# Altium project ESP32_Accelerometer.PrjPcb
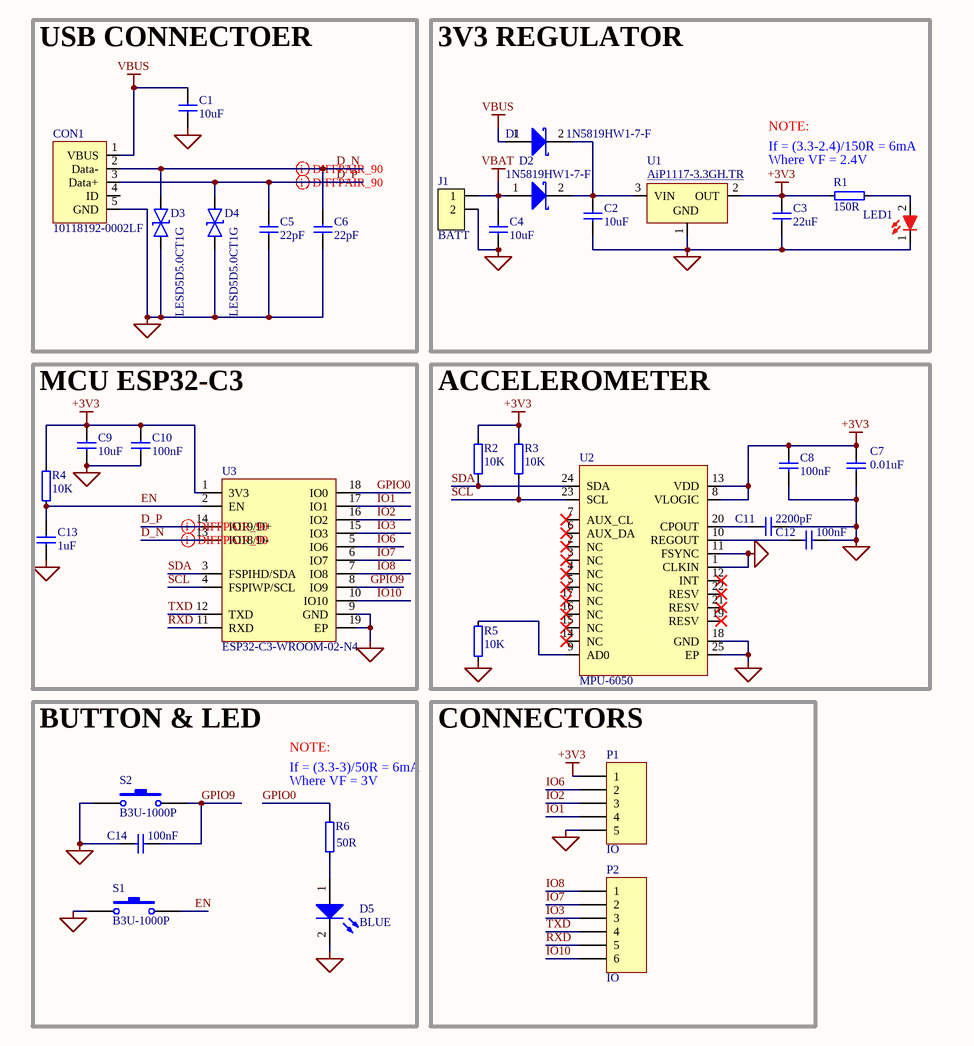
[diagram p0: ESP32_Accelerometer.SchDoc]
1 sheet, 35 parts. Net scope: global (net labels, ports and power ports of the same name join across sheets).
Board file: PCB.PcbDoc

## Sheet ESP32_Accelerometer.SchDoc
size A3

### Parts
C1  10uF  [CAPC1608X06L]
C2  10uF  [CAPC1608X06L]
C3  22uF  [CAPC1608X06L]
C4  10uF  [CAPC1608X06L]
C5  22pF  [CAPC1005X04L]
C6  22pF  [CAPC1005X04L]
C7  0.01uF  [CAPC1005X04L]
C8  100nF  [CAPC1005X04L]
C9  10uF  [CAPC1005X04L]
C10  100nF  [CAPC1005X04L]
C11  2200pF  [CAPC1005X04L]
C12  100nF  [CAPC1005X04L]
C13  1uF  [CAPC1005X04L]
C14  100nF  [CAPC1005X04L]
CON1  10118192-0002LF  [CONN_USB-B-MICRO-SMD-10118192-0002LF]
D1  1N5819HW1-7-F  [SOD-123FL]
D2  1N5819HW1-7-F  [SOD-123FL]
D3  LESD5D5.0CT1G  [SOD-523]
D4  LESD5D5.0CT1G  [SOD-523]
D5  BLUE  [LED_SMD_0402-BLUE]
J1  BATT  [CONN-TH_B2B-PH-K-S]
LED1  RED  [LED_SMD-0603]  (value not drawn)
P1  IO  [CONN_HEADER_5P_2mm]
P2  IO  [CONN_HEADER_6P_2mm]
R1  150R  [RESC1608X06N]
R2  10K  [RESC1005X04L_C]
R3  10K  [RESC1005X04L_C]
R4  10K  [RESC1005X04L_C]
R5  10K  [RESC1005X04L_C]
R6  50R  [RESC1005X04L_C]
S1  B3U-1000P  [BUTTON-SMD-2.3x3mm_2P_B3U-1000P]
S2  B3U-1000P  [BUTTON-SMD-2.3x3mm_2P_B3U-1000P]
U1  AiP1117-3.3GH.TR  [SOT-223]
U2  MPU-6050  [QFN-24_4x4mm]
U3  ESP32-C3-WROOM-02-N4  [ESP32-C3-WROOM-02-N4-4MB]

### Blocks framed on the sheet
USB CONNECTOER: C1 C5 C6 CON1 D3 D4
3V3 REGULATOR: C2-C4 D1 D2 J1 LED1 R1 U1
MCU ESP32-C3: C9 C10 C13 R4 U3
ACCELEROMETER: C7 C8 C11 C12 R2 R3 R5 U2
BUTTON & LED: C14 D5 R6 S1 S2
CONNECTORS: P1 P2

### Nets
+3V3: C3.1 C7.1 C8.1 C9.1 C10.1 P1.1 R1.2 R2.2 R3.2 R4.2 U1.2(OUT) U2.8(VLOGIC) U2.13(VDD) U3.1(3V3)
GND: C1.2 C2.2 C3.2 C4.2 C5.2 C6.2 C7.2 C8.2 C9.2 C10.2 C11.2 C12.2 C13.2 C14.1 CON1.5(GND) D3.1 D4.1 D5.2(K) J1.2 LED1.1(K) P1.5 R5.2 S1.2 S2.2 U1.1(GND) U2.1(CLKIN) U2.11(FSYNC) U2.18(GND) U2.25(EP) U3.9(GND) U3.19(EP)
VBAT: C4.1 D2.1(A) J1.1
VBUS: C1.1 CON1.1(VBUS) D1.1(A)
D_N: C6.1 CON1.2(Data-) D3.2 U3.13(IO18/D-)
D_P: C5.1 CON1.3(Data+) D4.2 U3.14(IO19/D+)
EN: C13.1 R4.1 S1.1 U3.2(EN)
GPIO0: R6.2 U3.18(IO0)
GPIO9: C14.2 S2.1 U3.8(IO9)
IO1: P1.4 U3.17(IO1)
IO2: P1.3 U3.16(IO2)
IO3: P2.3 U3.15(IO3)
IO6: P1.2 U3.5(IO6)
IO7: P2.2 U3.6(IO7)
IO8: P2.1 U3.7(IO8)
IO10: P2.6 U3.10(IO10)
RXD: P2.5 U3.11(RXD)
SCL: R3.1 U2.23(SCL) U3.4(FSPIWP/SCL)
SDA: R2.1 U2.24(SDA) U3.3(FSPIHD/SDA)
TXD: P2.4 U3.12(TXD)
NetC2_1: C2.1 D1.2(K) D2.2(K) U1.3(VIN)
NetC11_1: C11.1 U2.20(CPOUT)
NetC12_1: C12.1 U2.10(REGOUT)
NetD5_1: D5.1(A) R6.1
NetLED1_2: LED1.2(A) R1.1
NetR5_1: R5.1 U2.9(AD0)

Not connected (* = marked no-connect by the designer): CON1 4(ID); U2 2(NC)* 3(NC)* 4(NC)* 5(NC)* 6(AUX_DA)* 7(AUX_CL)* 12(INT)* 14(NC)* 15(NC)* 16(NC)* 17(NC)* 19(RESV)* 21(RESV)* 22(RESV)*

### Layout directives
differential pair; differential pair class 90-OHM: D_N, D_P

### Notes on the sheet
- NOTE:
- If = (3.3-2.4)/150R = 6mA
- Where VF = 2.4V
- (near R6) If = (3.3-3)/50R = 6mA
- (near R6) Where VF = 3V

### Library data of the parts
C1-C14 = C0402-1µ0: Capacitor, X5R, ±5%, 6.3V; ComponentLink1URL: N.A.; ComponentLink1Description: Datasheet; ComponentLink2URL: N.A.; ComponentLink2Description: Supplier link
  C1 C2 C4: LCSC: C18800; Package: 0603
  C3: LCSC: C84419; Package: 0603
  C5 C6: LCSC: C696857; Package: 0402
  C7 C11: LCSC: C267411; Package: 0402
  C8 C10 C12 C14: LCSC: C513772; Package: 0402
  C9 C13: LCSC: C2992625; Package: 0402
CON1 = CONN_USB-B-MICRO_SMD: LCSC: C2972784
D1 D2 = D Schottky: Schottky Diode; LCSC: C117948
D5 = LED0: Typical INFRARED GaAs LED; LCSC: C2844007
J1 = SM03B-SRSS-TB: 1.0mm pitch connector side entry SMD; Manufacturer: JST Sales America Inc.; Manufacturer Part Number: SM03B-SRSS-TB(LF)(SN); Part number IPS: 00000001785; Value: HDR-3, 1mm; Note: JST, Header; Artikkelnr Noca: N.A.; Pad Count: 3; Part Number: SM03B-SRSS-TB; Footprint Doc: SM03B-SRSS-TB; LatestRevisionDate: 2017-10-09; Published: 2017-10-09; ComponentLink1URL: N.A.; ComponentLink1Description: Datasheet; ComponentLink2URL: N.A.; ComponentLink2Description: Supplier link; HelpURL: http://www.jst-mfg.com/product/pdf/eng/eSH.pdf; Supplier 1: Cabcon; Supplier Part Number 1: SM03B-SRSS-TB(LF)(SN); Supplier 2: Digi-Key; Supplier Part Number 2: 455-1803-1-ND; Component Class: Connectors; PartId: 100500605; LCSC: C131337
LED1 = LED0603_RED: LED RED CLEAR SMD; Manufacturer: Vishay Lite-On; Manufacturer Part Number: LTST-C191KRKT; Lens Color: Colorless; Power Rating: 75mW; Luminous Intensity: 54mcd; Viewing Angle: 130°; Forward Voltage: 2V; Lens Style: Clear,Diffused,Colorless,Rectangular; Forward Current: 30mA; Dominant Wavelength: 631nm; Test Current: 20mA; Number of Elements: 1; Wavelength: 639nm; Reverse Voltage: 5V; Supplier 1: Digi-Key; Supplier Part Number 1: 160-1447-1-ND; RoHS: Yes; Category: LEDs; Stock 1: 1209111; Pricing 1: 1=0.26000, 10=0.14100, 100=0.06560, 500=0.06060, 1000=0.04747, 2000=0.04646 (USD); Mount: Surface Mount; Case/Package: 0603; Number of Pins: 2; Color: Red; Case Code (Metric): 1608; Case Code (Imperial): 0603; Min Operating Temperature: -55°C; Max Operating Temperature: 85°C; Packaging: Tape and Reel; Package Quantity: 1; Illumination Color: Red; Lens Transparency: Clear; Power Dissipation: 75mW; Number of LEDs: 1; Voltage: 2V; Length: 1.6mm; Width: 0.8mm; Height: 0.55mm; Depth: 0.8mm; Radiation Hardening: No; Lead Free: Lead Free; RoHS Compliant: Yes; ComponentLink1URL: https://datasheet.ciiva.com/11773/0900766b80dc02b2-11773601.pdf?src-supplier=RSComponents; ComponentLink1Description: https://datasheet.ciiva.com/11773/0900766b80dc02b2-11773601.pdf?src-supplier=RSComponents; ComponentLink2URL: https://datasheet.ciiva.com/12400/lite-on-ltst-c191krkt-190135-12400910.pdf?src-supplier=Mouser; ComponentLink2Description: https://datasheet.ciiva.com/12400/lite-on-ltst-c191krkt-190135-12400910.pdf?src-supplier=Mouser; ComponentLink3URL: https://datasheet.ciiva.com/16212/ltst-c191krkt-16212419.pdf?src-supplier=Future+Electronics; ComponentLink3Description: https://datasheet.ciiva.com/16212/ltst-c191krkt-16212419.pdf?src-supplier=Future+Electronics; ComponentLink4URL: https://datasheet.ciiva.com/15117/getdatasheetpartid-141922-15117737.pdf?src-supplier=Verical; ComponentLink4Description: https://datasheet.ciiva.com/15117/getdatasheetpartid-141922-15117737.pdf?src-supplier=Verical; ComponentLink5URL: https://datasheet.ciiva.com/2109/s-110-ltst-c191krkt-2109971.pdf?src-supplier=Digi-Key; ComponentLink5Description: https://datasheet.ciiva.com/2109/s-110-ltst-c191krkt-2109971.pdf?src-supplier=Digi-Key; ComponentLink6URL: https://datasheet.ciiva.com/2109/s-110-ltst-c191krkt-2109970.pdf?src-supplier=Digi-Key; ComponentLink6Description: https://datasheet.ciiva.com/2109/s-110-ltst-c191krkt-2109970.pdf?src-supplier=Digi-Key; ComponentLink7URL: https://datasheet.ciiva.com/2109/s-110-ltst-c191krkt-2109972.pdf?src-supplier=Digi-Key; ComponentLink7Description: https://datasheet.ciiva.com/2109/s-110-ltst-c191krkt-2109972.pdf?src-supplier=Digi-Key; LCSC: C125099
P1 = Header 5: Header, 5-Pin; LCSC: C541859
P2 = Header 6: Header, 6-Pin; LCSC: C917593
R1 = R0201-10k: Resistor, ±1%, 0.05W; ComponentLink1URL: N.A.; ComponentLink1Description: Datasheet; ComponentLink2URL: N.A.; ComponentLink2Description: Supplier link; Package: 0603; LCSC: C778412
R2-R6 = R0201-2R2: Resistor, ±1%, 0.05W; ComponentLink1URL: N.A.; ComponentLink1Description: Datasheet; ComponentLink2URL: N.A.; ComponentLink2Description: Supplier link; Package: 0402
  R2-R5: LCSC: C328298
  R6: LCSC: C853312
S1 S2 = SW-PB: Switch; LCSC: C231329; Package: SMD
U1 = AiP1117-3.3: LCSC: C2943304
D3 D4 = LESD5D5.0CT1G: LCSC: C383211
U2 = MPU-6050: LCSC: C24112
U3 = ESP32-C3-WROOM-02-N4: LCSC: C2934560